# Altium schematic sheet CPU.SchDoc: AMC FMC Carrier v4.0.5
size 420 x 297 mm; CompanyName: WUT; Organization: WUT ISE; Address1: Warsaw University of Technology; Address2: Nowowiejska 15/19 00-665 Warsaw; Address3: t.przywozki@gmail.com; Revision: 1; SheetNumber: 18; SheetTotal: 29; Project: AMC FMC Carrier v4.0.5; ModifiedBy: F. Świtakowski; CheckedDate: -; Title2: MMC; DivGrp: ISE; Designer: T. Przywozki; ModifiedDate: -; ProjectName: ADC/DAC MEZZANINE
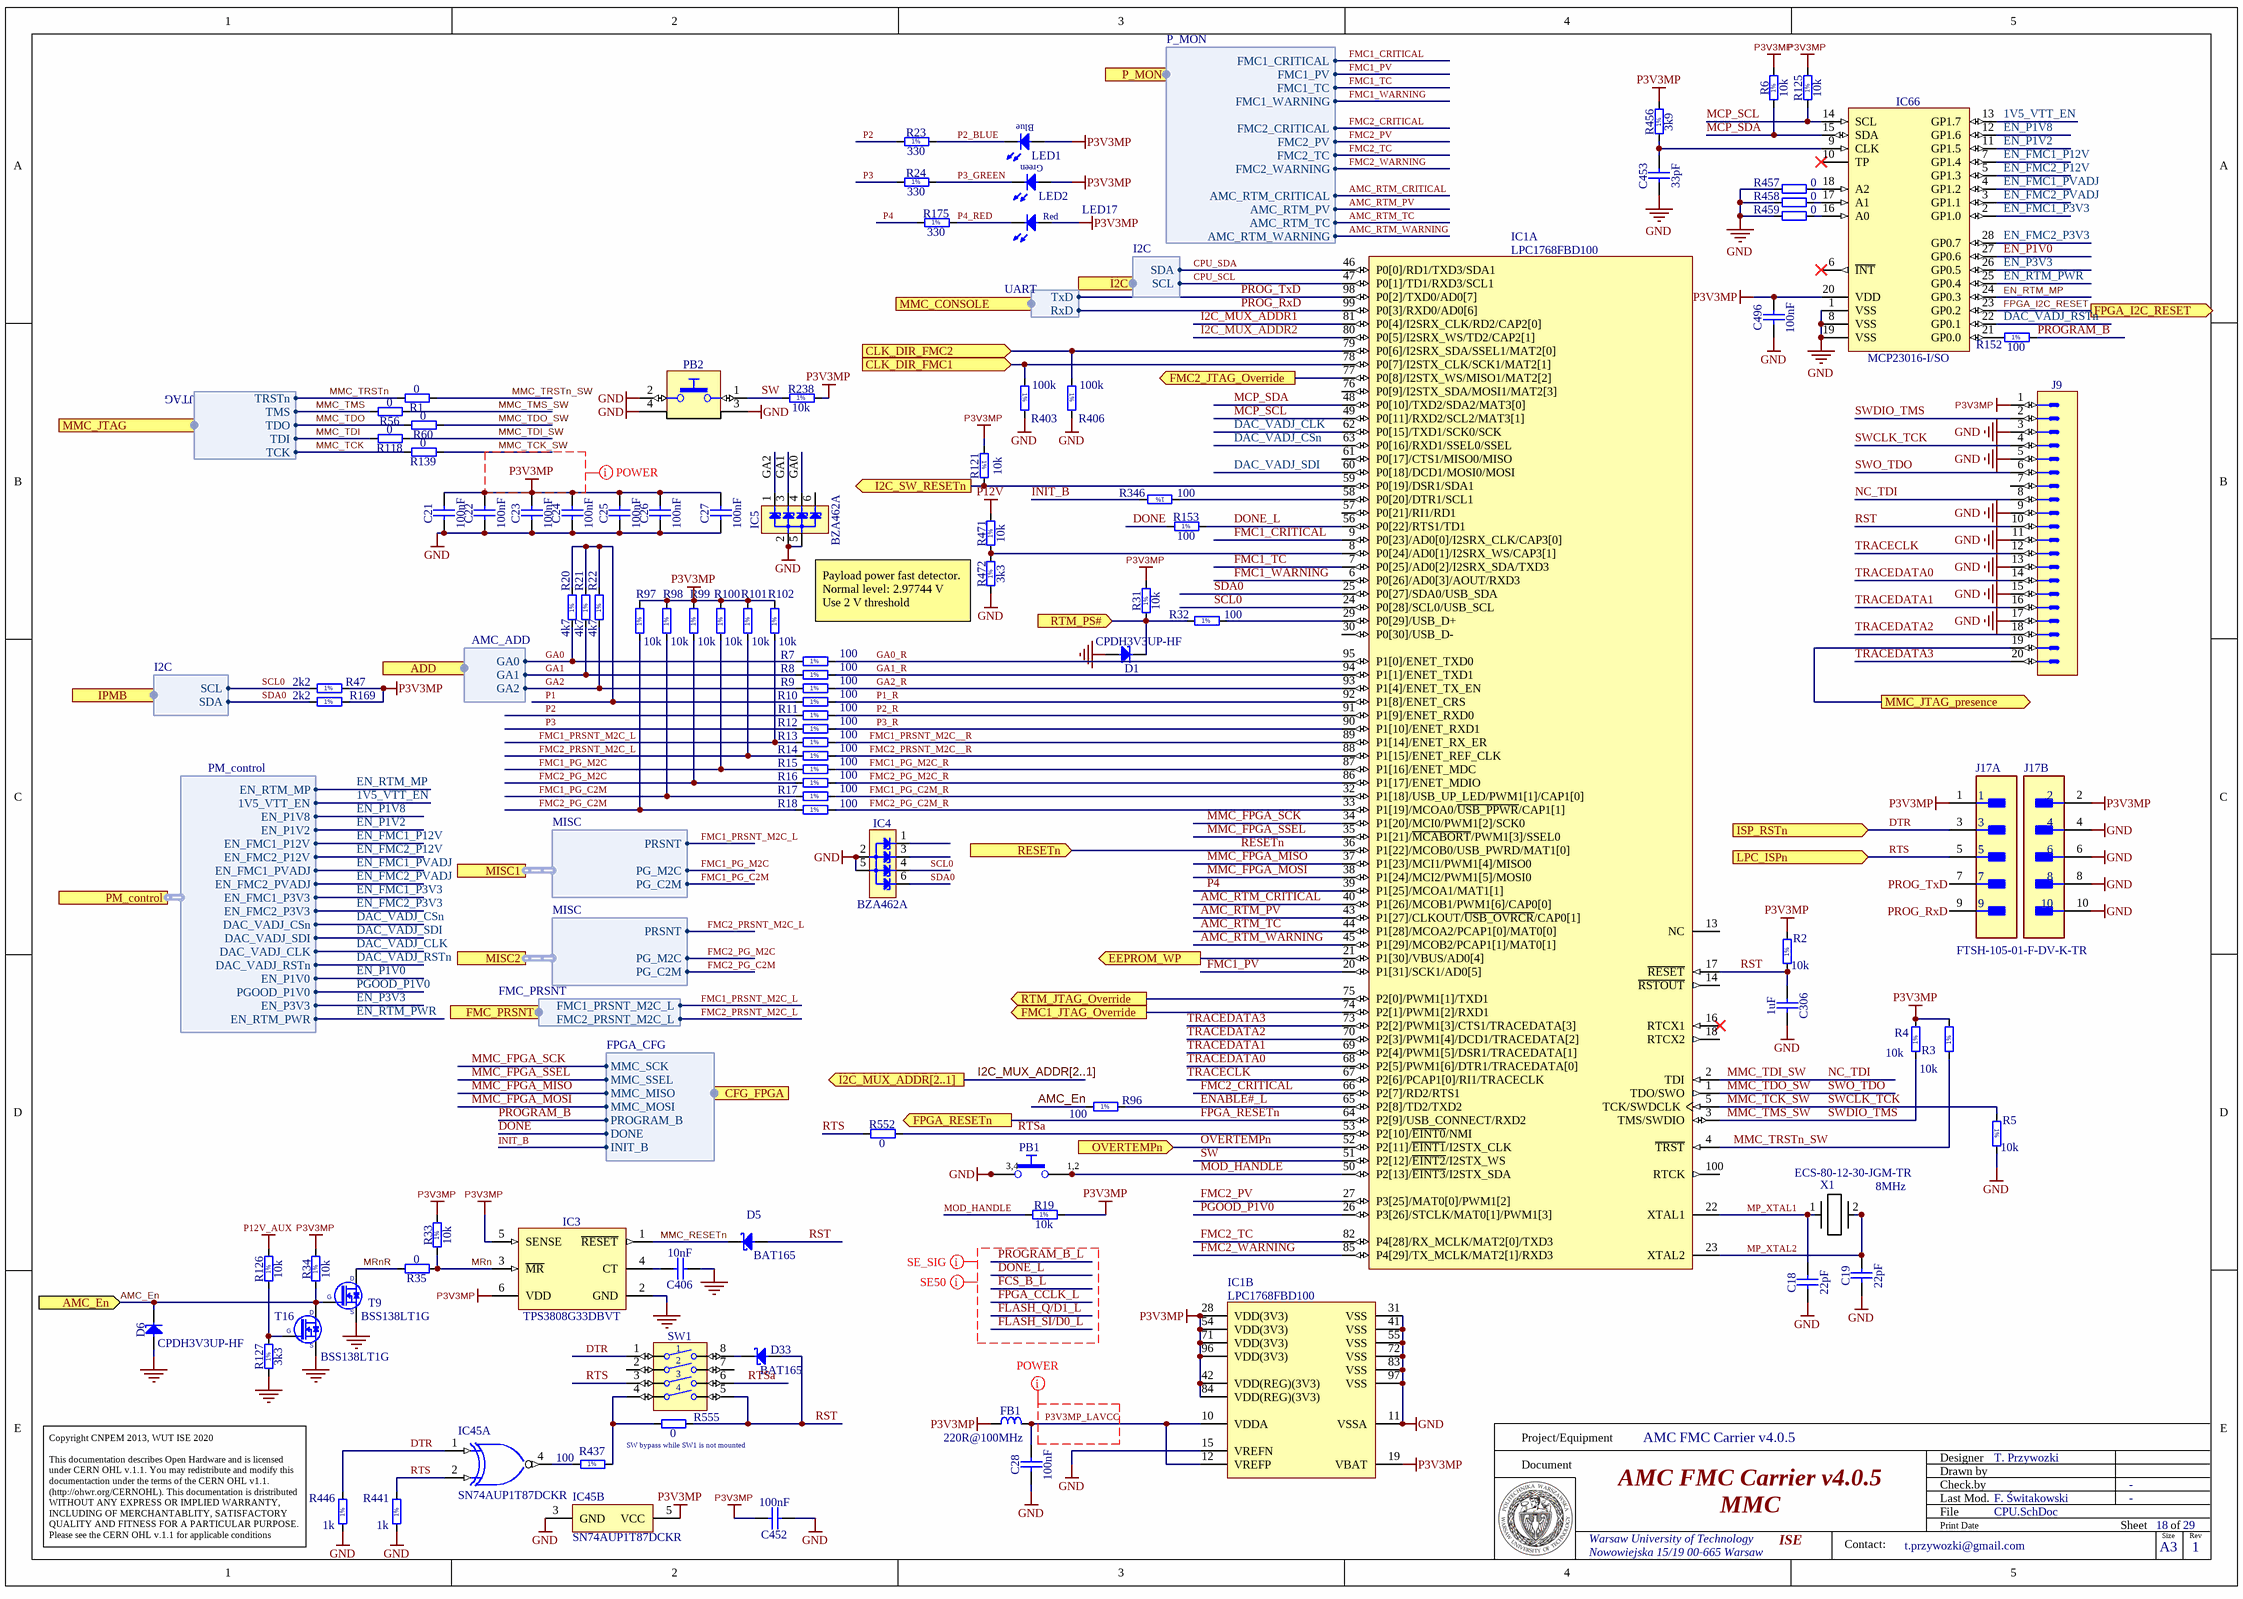
[diagram p0: CPU.SchDoc]

## Parts
C18  22pF  [CAPC1005X55N]
C19  22pF  [CAPC1005X55N]
C21  100nF  [CAPC0603X33N]
C22  100nF  [CAPC0603X33N]
C23  100nF  [CAPC0603X33N]
C24  100nF  [CAPC0603X33N]
C25  100nF  [CAPC0603X33N]
C26  100nF  [CAPC0603X33N]
C27  100nF  [CAPC0603X33N]
C28  100nF  [CAPC0603X33N]
C306  1uF  [CAPC1608X87N]
C406  10nF  [CAPC1005X55N]
C452  100nF  [CAPC0603X33N]
C453  33pF  [CAPC1005X55N]
C496  100nF  [CAPC0603X33N]
D1  CPDH3V3UP-HF  [SODFL1608X65N]
D5  BAT165  [SOD2512X110N]
D6  CPDH3V3UP-HF  [SODFL1608X65N]
D33  BAT165  [SOD2512X110N]
FB1  220R@100MHz  [INDC2012X105N]
IC1  LPC1768FBD100  [QFP50P1600X1600X160-100N]  (parts A,B of 2)
IC3  TPS3808G33DBVT  [SOT95P280X145-6N]
IC4  BZA462A  [SOT95P275X110-6N]
IC5  BZA462A  [SOT95P275X110-6N]
IC45  SN74AUP1T87DCKR  [DCK0005A_L]  (parts A,B of 2)
IC66  MCP23016-I/SO  [SOIC127P1030X265-28N]
J9  Header 20  [SAMTEC_FTSH-110-01-F-DV-K]  (value not drawn)
J17  FTSH-105-01-F-DV-K-TR  [FP-FTSH-105-01-F-DV-K-TR-MFG]  (parts A,B of 2)
LED1  Blue  [LED_AVAGO_HSME-C120rev]  (value not drawn)
LED2  Green  [LED_AVAGO_HSME-C120rev]  (value not drawn)
LED17  Red  [LED_KINGBRIGHT_KPH-1608SURCK]
PB1  Push Button  [SW_C&K_HDT0001]  (value not drawn)
PB2  Push Button  [PB_ALPS_SKHHLMA010]  (value not drawn)
R1  0  [RESC1005X40N]
R2  10k  [RESC1005X40N]
R3  10k  [RESC1005X40N]
R4  10k  [RESC1005X40N]
R5  10k  [RESC1005X40N]
R6  10k  [RESC1005X40N]
R7  100  [RESC1005X40N]
R8  100  [RESC1005X40N]
R9  100  [RESC1005X40N]
R10  100  [RESC1005X40N]
R11  100  [RESC1005X40N]
R12  100  [RESC1005X40N]
R13  100  [RESC1005X40N]
R14  100  [RESC1005X40N]
R15  100  [RESC1005X40N]
R16  100  [RESC1005X40N]
R17  100  [RESC1005X40N]
R18  100  [RESC1005X40N]
R19  10k  [RESC1005X40N]
R20  4k7  [RESC1005X40N]
R21  4k7  [RESC1005X40N]
R22  4k7  [RESC1005X40N]
R23  330  [RESC1005X40N]
R24  330  [RESC1005X40N]
R31  10k  [RESC1005X40N]
R32  100  [RESC1005X40N]
R33  10k  [RESC1005X40N]
R34  10k  [RESC1005X40N]
R35  0  [RESC1005X40N]
R47  2k2  [RESC1005X40N]
R56  0  [RESC1005X40N]
R60  0  [RESC1005X40N]
R96  100  [RESC1005X40N]
R97  10k  [RESC1005X40N]
R98  10k  [RESC1005X40N]
R99  10k  [RESC1005X40N]
R100  10k  [RESC1005X40N]
R101  10k  [RESC1005X40N]
R102  10k  [RESC1005X40N]
R118  0  [RESC1005X40N]
R121  10k  [RESC1005X40N]
R125  10k  [RESC1005X40N]
R126  10k  [RESC1005X40N]
R127  3k3  [RESC1608X55N]
R139  0  [RESC1005X40N]
R152  100  [RESC1005X40N]
R153  100  [RESC1005X40N]
R169  2k2  [RESC1005X40N]
R175  330  [RESC1005X40N]
R238  10k  [RESC1005X40N]
R346  100  [RESC1005X40N]
R403  100k  [RESC1005X40N]
R406  100k  [RESC1005X40N]
R437  100  [RESC1005X40N]
R441  1k  [RESC1005X40N]
R446  1k  [RESC1005X40N]
R456  3k9  [RESC1005X40N]
R457  0  [RESC1005X40N]
R458  0  [RESC1005X40N]
R459  0  [RESC1005X40N]
R471  10k  [RESC1005X40N]
R472  3k3  [RESC1608X55N]
R552  0  [RESC1005X40N]
R555  0  [RESC1005X40N]
SW1  Switch  [SW_TYCO_1571983-4]  (value not drawn)
T9  BSS138LT1G  [SOT95P240X110-3N]
T16  BSS138LT1G  [SOT95P240X110-3N]
X1  ECS-80-12-30-JGM-TR  Frequency: 8MHz  [ECS-80-12-30-JGM-TR]

## Ports
ADD (harness AMC_ADD), AMC_En (in), CFG_FPGA (harness FPGA_CFG), CLK_DIR_FMC1 (in), CLK_DIR_FMC2 (in), EEPROM_WP (out), FMC1_JTAG_Override (out), FMC2_JTAG_Override (out), FMC_PRSNT (harness FMC_PRSNT), FPGA_I2C_RESET (out), FPGA_RESETn (out), I2C (harness I2C), I2C_MUX_ADDR[2..1] (out), I2C_SW_RESETn (out), IPMB (harness I2C), ISP_RSTn (in), LPC_ISPn (in), MISC1 (harness MISC), MISC2 (harness MISC), MMC_CONSOLE (harness UART), MMC_JTAG (harness JTAG), MMC_JTAG_presence (out), OVERTEMPn (in), P_MON (harness P_MON), PM_control (harness PM_control), RESETn (in), RTM_JTAG_Override (out), RTM_PS# (in)

## Harnesses
PM_control: EN_P1V8, EN_P1V2, EN_FMC1_P12V, EN_FMC2_P12V, EN_FMC1_PVADJ, EN_FMC2_PVADJ, EN_FMC1_P3V3, EN_FMC2_P3V3, DAC_VADJ_CSn, DAC_VADJ_SDI, DAC_VADJ_CLK, DAC_VADJ_RSTn, 1V5_VTT_EN, EN_P1V0, PGOOD_P1V0, EN_P3V3, EN_RTM_PWR, EN_RTM_MP
I2C: SCL, SDA
MISC: PRSNT, PG_M2C, PG_C2M
AMC_ADD: GA0, GA1, GA2
JTAG: TCK, TDI, TDO, TMS, TRSTn
UART: RxD, TxD
P_MON: FMC1_CRITICAL, FMC1_TC, FMC1_WARNING, AMC_RTM_CRITICAL, FMC2_WARNING, AMC_RTM_PV, FMC2_CRITICAL, AMC_RTM_TC, FMC2_PV, AMC_RTM_WARNING, FMC2_TC, FMC1_PV
FPGA_CFG: MMC_MISO, MMC_MOSI, PROGRAM_B, DONE, INIT_B, MMC_SSEL, MMC_SCK
FMC_PRSNT: FMC1_PRSNT_M2C_L, FMC2_PRSNT_M2C_L

## Nets
GND: C18.1 C19.1 C21.1 C22.1 C23.1 C24.1 C25.1 C26.1 C27.1 C28.2 C306.2 C406.1 C452.2 C453.1 C496.2 D1.2(A) D6.2(A) IC1.11(VSSA) IC1.15(VREFN) IC1.31(VSS) IC1.41(VSS) IC1.55(VSS) IC1.72(VSS) IC1.83(VSS) IC1.97(VSS) IC3.2(GND) IC4.2(A) IC4.5(A) IC5.2(A) IC5.5(A) IC45.3(GND) IC66.1(VSS) IC66.8(VSS) IC66.19(VSS) J9.3 J9.5 J9.9 J9.11 J9.13 J9.15 J9.17 J17.4 J17.6 J17.8 J17.10 PB1.3 PB1.4 PB2.2 PB2.3 PB2.4 R5.1 R127.1 R403.2 R406.2 R441.1 R446.1 R457.1 R458.1 R459.1 R472.1 T9.2(S) T16.2(S)
P3V3MP: C21.2 C22.2 C23.2 C24.2 C25.2 C26.2 C27.2 C452.1 C496.1 FB1.2 IC1.19(VBAT) IC1.28(VDD(3V3)) IC1.42(VDD(REG)(3V3)) IC1.54(VDD(3V3)) IC1.71(VDD(3V3)) IC1.84(VDD(REG)(3V3)) IC1.96(VDD(3V3)) IC3.5(SENSE) IC3.6(VDD) IC45.5(VCC) IC66.20(VDD) J9.1 J17.1 J17.2 LED1.1(A) LED2.1(A) LED17.2(A) R2.2 R3.2 R4.2 R6.2 R19.2 R31.2 R33.2 R34.2 R47.1 R97.2 R98.2 R99.2 R100.2 R101.2 R102.2 R121.1 R125.2 R169.1 R238.2 R456.2
P12V: R471.2
P12V_AUX: R126.2
1V5_VTT_EN: IC66.13(GP1.7) ; port PM_control.1V5_VTT_EN
AMC_En: D6.1(C) R34.1 R96.1 T9.1(G) T16.3(D) ; port AMC_En
AMC_RTM_CRITICAL: IC1.40(P1[26]/MCOB1/PWM1[6]/CAP0[0]) ; port P_MON.AMC_RTM_CRITICAL
AMC_RTM_PV: IC1.43(P1[27]/CLKOUT/~{USB_OVRCR}/CAP0[1]) ; port P_MON.AMC_RTM_PV
AMC_RTM_TC: IC1.44(P1[28]/MCOA2/PCAP1[0]/MAT0[0]) ; port P_MON.AMC_RTM_TC
AMC_RTM_WARNING: IC1.45(P1[29]/MCOB2/PCAP1[1]/MAT0[1]) ; port P_MON.AMC_RTM_WARNING
CLK_DIR_FMC1: IC1.78(P0[7]/I2STX_CLK/SCK1/MAT2[1]) R403.1 ; port CLK_DIR_FMC1
CLK_DIR_FMC2: IC1.79(P0[6]/I2SRX_SDA/SSEL1/MAT2[0]) R406.1 ; port CLK_DIR_FMC2
CPU_SCL: IC1.47(P0[1]/TD1/RXD3/SCL1) ; port I2C.SCL
CPU_SDA: IC1.46(P0[0]/RD1/TXD3/SDA1) ; port I2C.SDA
DAC_VADJ_CLK: IC1.62(P0[15]/TXD1/SCK0/SCK) ; port PM_control.DAC_VADJ_CLK
DAC_VADJ_CSn: IC1.63(P0[16]/RXD1/SSEL0/SSEL) ; port PM_control.DAC_VADJ_CSn
DAC_VADJ_RSTn: IC66.22(GP0.1) ; port PM_control.DAC_VADJ_RSTn
DAC_VADJ_SDI: IC1.60(P0[18]/DCD1/MOSI0/MOSI) ; port PM_control.DAC_VADJ_SDI
DONE: R153.2 ; port CFG_FPGA.DONE
DONE_L: IC1.56(P0[22]/RTS1/TD1) R153.1
DTR: IC45.1(A) J17.3 R446.2 SW1.1 ; port ISP_RSTn
EEPROM_WP: IC1.21(P1[30]/VBUS/AD0[4]) ; port EEPROM_WP
EN_FMC1_P3V3: IC66.2(GP1.0) ; port PM_control.EN_FMC1_P3V3
EN_FMC1_P12V: IC66.7(GP1.4) ; port PM_control.EN_FMC1_P12V
EN_FMC1_PVADJ: IC66.4(GP1.2) ; port PM_control.EN_FMC1_PVADJ
EN_FMC2_P3V3: IC66.28(GP0.7) ; port PM_control.EN_FMC2_P3V3
EN_FMC2_P12V: IC66.5(GP1.3) ; port PM_control.EN_FMC2_P12V
EN_FMC2_PVADJ: IC66.3(GP1.1) ; port PM_control.EN_FMC2_PVADJ
EN_P1V0: IC66.27(GP0.6) ; port PM_control.EN_P1V0
EN_P1V2: IC66.11(GP1.5) ; port PM_control.EN_P1V2
EN_P1V8: IC66.12(GP1.6) ; port PM_control.EN_P1V8
EN_P3V3: IC66.26(GP0.5) ; port PM_control.EN_P3V3
EN_RTM_MP: IC66.24(GP0.3) ; port PM_control.EN_RTM_MP
EN_RTM_PWR: IC66.25(GP0.4) ; port PM_control.EN_RTM_PWR
ENABLE#_L: IC1.65(P2[8]/TD2/TXD2) R96.2
FMC1_CRITICAL: IC1.9(P0[23]/AD0[0]/I2SRX_CLK/CAP3[0]) ; port P_MON.FMC1_CRITICAL
FMC1_JTAG_Override: IC1.74(P2[1]/PWM1[2]/RXD1) ; port FMC1_JTAG_Override
FMC1_PG_C2M: R17.1 R98.1 ; port MISC1.PG_C2M
FMC1_PG_C2M_R: IC1.32(P1[18]/USB_UP_LED/PWM1[1]/CAP1[0]) R17.2
FMC1_PG_M2C: R15.1 R100.1 ; port MISC1.PG_M2C
FMC1_PG_M2C_R: IC1.87(P1[16]/ENET_MDC) R15.2
FMC1_PRSNT_M2C__R: IC1.89(P1[14]/ENET_RX_ER) R13.2
FMC1_PRSNT_M2C_L: R13.1 R102.1 ; port MISC1.PRSNT, port FMC_PRSNT.FMC1_PRSNT_M2C_L
FMC1_PV: IC1.20(P1[31]/SCK1/AD0[5]) ; port P_MON.FMC1_PV
FMC1_TC: IC1.7(P0[25]/AD0[2]/I2SRX_SDA/TXD3) ; port P_MON.FMC1_TC
FMC1_WARNING: IC1.6(P0[26]/AD0[3]/AOUT/RXD3) ; port P_MON.FMC1_WARNING
FMC2_CRITICAL: IC1.66(P2[7]/RD2/RTS1) ; port P_MON.FMC2_CRITICAL
FMC2_JTAG_Override: IC1.77(P0[8]/I2STX_WS/MISO1/MAT2[2]) ; port FMC2_JTAG_Override
FMC2_PG_C2M: R18.1 R97.1 ; port MISC2.PG_C2M
FMC2_PG_C2M_R: IC1.33(P1[19]/MCOA0/~{USB_PPWR}/CAP1[1]) R18.2
FMC2_PG_M2C: R16.1 R99.1 ; port MISC2.PG_M2C
FMC2_PG_M2C_R: IC1.86(P1[17]/ENET_MDIO) R16.2
FMC2_PRSNT_M2C__R: IC1.88(P1[15]/ENET_REF_CLK) R14.2
FMC2_PRSNT_M2C_L: R14.1 R101.1 ; port MISC2.PRSNT, port FMC_PRSNT.FMC2_PRSNT_M2C_L
FMC2_PV: IC1.27(P3[25]/MAT0[0]/PWM1[2]) ; port P_MON.FMC2_PV
FMC2_TC: IC1.82(P4[28]/RX_MCLK/MAT2[0]/TXD3) ; port P_MON.FMC2_TC
FMC2_WARNING: IC1.85(P4[29]/TX_MCLK/MAT2[1]/RXD3) ; port P_MON.FMC2_WARNING
FPGA_I2C_RESET: IC66.23(GP0.2) ; port FPGA_I2C_RESET
FPGA_RESETn: IC1.64(P2[9]/USB_CONNECT/RXD2) ; port FPGA_RESETn
GA0: IC5.4(C3) R7.1 R20.1 ; port ADD.GA0
GA0_R: IC1.95(P1[0]/ENET_TXD0) R7.2
GA1: IC5.3(C2) R8.1 R21.1 ; port ADD.GA1
GA1_R: IC1.94(P1[1]/ENET_TXD1) R8.2
GA2: IC5.1(C1) R9.1 R22.1 ; port ADD.GA2
GA2_R: IC1.93(P1[4]/ENET_TX_EN) R9.2
I2C_MUX_ADDR1: IC1.81(P0[4]/I2SRX_CLK/RD2/CAP2[0])
I2C_MUX_ADDR2: IC1.80(P0[5]/I2SRX_WS/TD2/CAP2[1])
I2C_SW_RESETn: IC1.59(P0[19]/DSR1/SDA1) R121.2 ; port I2C_SW_RESETn
INIT_B: R346.1 ; port CFG_FPGA.INIT_B
MCP_SCL: IC1.49(P0[11]/RXD2/SCL2/MAT3[1]) IC66.14(SCL) R125.1
MCP_SDA: IC1.48(P0[10]/TXD2/SDA2/MAT3[0]) IC66.15(SDA) R6.1
MMC_FPGA_MISO: IC1.37(P1[23]/MCI1/PWM1[4]/MISO0) ; port CFG_FPGA.MMC_MISO
MMC_FPGA_MOSI: IC1.38(P1[24]/MCI2/PWM1[5]/MOSI0) ; port CFG_FPGA.MMC_MOSI
MMC_FPGA_SCK: IC1.34(P1[20]/MCI0/PWM1[2]/SCK0) ; port CFG_FPGA.MMC_SCK
MMC_FPGA_SSEL: IC1.35(P1[21]/~{MCABORT}/PWM1[3]/SSEL0) ; port CFG_FPGA.MMC_SSEL
MMC_JTAG_presence: J9.19 ; port MMC_JTAG_presence
MMC_RESETn: D5.1(C) IC3.1(~{RESET})
MMC_TCK: R139.2 ; port MMC_JTAG.TCK
MMC_TCK_SW: IC1.5(TCK/SWDCLK) J9.4 R5.2 R139.1  [also labelled SWCLK_TCK]
MMC_TDI: R118.2 ; port MMC_JTAG.TDI
MMC_TDI_SW: IC1.2(TDI) J9.8 R118.1  [also labelled NC_TDI]
MMC_TDO: R60.2 ; port MMC_JTAG.TDO
MMC_TDO_SW: IC1.1(TDO/SWO) J9.6 R60.1  [also labelled SWO_TDO]
MMC_TMS: R56.2 ; port MMC_JTAG.TMS
MMC_TMS_SW: IC1.3(TMS/SWDIO) J9.2 R4.1 R56.1  [also labelled SWDIO_TMS]
MMC_TRSTn: R1.2 ; port MMC_JTAG.TRSTn
MMC_TRSTn_SW: IC1.4(~{TRST}) R1.1 R3.1
MOD_HANDLE: IC1.50(P2[13]/~{EINT3}/I2STX_SDA) PB1.1 PB1.2 R19.1
MP_XTAL1: C18.2 IC1.22(XTAL1) X1.1
MP_XTAL2: C19.2 IC1.23(XTAL2) X1.2
MRn: IC3.3(~{MR}) R33.1 R35.1
MRnR: R35.2 T9.3(D)
OVERTEMPn: IC1.52(P2[11]/~{EINT1}/I2STX_CLK) ; port OVERTEMPn
P1: R10.1 R20.2 R21.2 R22.2
P1_R: IC1.92(P1[8]/ENET_CRS) R10.2
P2: R11.1 R23.1
P2_BLUE: LED1.2(C) R23.2
P2_R: IC1.91(P1[9]/ENET_RXD0) R11.2
P3: R12.1 R24.1
P3_GREEN: LED2.2(C) R24.2
P3_R: IC1.90(P1[10]/ENET_RXD1) R12.2
P3V3MP_LAVCC: C28.1 FB1.1 IC1.10(VDDA) IC1.12(VREFP)
P4: IC1.39(P1[25]/MCOA1/MAT1[1]) R175.1
P4_RED: LED17.1(C) R175.2
PGOOD_P1V0: IC1.26(P3[26]/STCLK/MAT0[1]/PWM1[3]) ; port PM_control.PGOOD_P1V0
PROG_RxD: IC1.99(P0[3]/RXD0/AD0[6]) J17.9 ; port MMC_CONSOLE.RxD
PROG_TxD: IC1.98(P0[2]/TXD0/AD0[7]) J17.7 ; port MMC_CONSOLE.TxD
PROGRAM_B: R152.1 ; port CFG_FPGA.PROGRAM_B
RESETn: IC1.36(P1[22]/MCOB0/USB_PWRD/MAT1[0]) ; port RESETn
RST: C306.1 D5.2(A) D33.2(A) IC1.17(~{RESET}) J9.10 R2.1 R555.2 SW1.5
RTM_JTAG_Override: IC1.75(P2[0]/PWM1[1]/TXD1) ; port RTM_JTAG_Override
RTM_PS#: D1.1(C) R31.1 R32.2 ; port RTM_PS#
RTS: IC45.2(B) J17.5 R441.2 R552.1 SW1.3 ; port LPC_ISPn
RTSa: IC1.53(P2[10]/~{EINT0}/NMI) R552.2 SW1.6
SCL0: IC1.24(P0[28]/SCL0/USB_SCL) IC4.4(C3) R47.2 ; port IPMB.SCL
SDA0: IC1.25(P0[27]/SDA0/USB_SDA) IC4.6(C4) R169.2 ; port IPMB.SDA
SW: IC1.51(P2[12]/~{EINT2}/I2STX_WS) PB2.1 R238.1
TRACECLK: IC1.67(P2[6]/PCAP1[0]/RI1/TRACECLK) J9.12
TRACEDATA0: IC1.68(P2[5]/PWM1[6]/DTR1/TRACEDATA[0]) J9.14
TRACEDATA1: IC1.69(P2[4]/PWM1[5]/DSR1/TRACEDATA[1]) J9.16
TRACEDATA2: IC1.70(P2[3]/PWM1[4]/DCD1/TRACEDATA[2]) J9.18
TRACEDATA3: IC1.73(P2[2]/PWM1[3]/CTS1/TRACEDATA[3]) J9.20
NetC406_2: C406.2 IC3.4(CT)
NetC453_2: C453.2 IC66.9(CLK) R456.1
NetD33_1: D33.1(C) SW1.8
NetIC1_8: IC1.8(P0[24]/AD0[1]/I2SRX_WS/CAP3[1]) R471.1 R472.2
NetIC1_29: IC1.29(P0[29]/USB_D+) R32.1
NetIC1_58: IC1.58(P0[20]/DTR1/SCL1) R346.2
NetIC45_4: IC45.4(Y) R437.1
NetIC66_16: IC66.16(A0) R459.2
NetIC66_17: IC66.17(A1) R458.2
NetIC66_18: IC66.18(A2) R457.2
NetIC66_21: IC66.21(GP0.0) R152.2
NetR126_1: R126.1 R127.2 T16.1(G)
NetR437_2: R437.2 R555.1 SW1.4

Not connected (* = marked no-connect by the designer): IC1 13(NC) 14(~{RSTOUT}) 16(RTCX1)* 18(RTCX2) 30(P0[30]/USB_D-) 57(P0[21]/RI1/RD1) 61(P0[17]/CTS1/MISO0/MISO) 76(P0[9]/I2STX_SDA/MOSI1/MAT2[3]) 100(RTCK); IC4 1(C1) 3(C2); IC5 6(C4); IC66 6(~{INT})* 10(TP)*; J9 7; SW1 2 7

## Buses and harness runs
bus I2C_MUX_ADDR[2..1] = port I2C_MUX_ADDR[2..1]

## Layout directives
net class POWER: MMC_TCK_SW, P3V3MP, P3V3MP_LAVCC
net class SE_SIG: DONE_L, FCS_~{B}_L, FLASH_Q/D1_L, FLASH_SI/D0_L, FPGA_CCLK_L, PROGRAM_B_L
net class SE50: DONE_L, FCS_~{B}_L, FLASH_Q/D1_L, FLASH_SI/D0_L, FPGA_CCLK_L, PROGRAM_B_L

## Notes on the sheet
- Payload power fast detector.
  Normal level: 2.97744 V
  Use 2 V threshold
- SW bypass while SW1 is not mounted
- Project/Equipment
- Document
- Designer
- Drawn by
- Check.by
- Copyright CNPEM 2013, WUT ISE 2020
  This documentation describes Open Hardware and is licensed under CERN OHL v.1.1. You may redistribute and modify this documentaction under the terms of the CERN OHL v1.1.
  (http://ohwr.org/CERNOHL). This documentation is dristributed WITHOUT ANY EXPRESS OR IMPLIED WARRANTY, INCLUDING OF MERCHANTABLITY, SATISFACTORY QUALITY AND FITNESS FOR A PARTICULAR PURPOSE. Please see the CERN OHL v.1.1 for applicable conditions
- File
- Last Mod.
- Print Date
- Sheet
- Size
- A3
- of
- Rev
- Contact:
- (in symbol R0402_1K_1%_0.0625W_100PPM) 1%
- (in symbol R0402_2K2_1%_0.0625W_100PPM) 1%
- (in symbol R0402_3K9_1%_0.0625W_100PPM) 1%
- (in symbol R0402_4K7_1%_0.0625W_100PPM) 1%
- (in symbol R0402_10K_1%_0.0625W_100PPM) 1%
- (in symbol R0402_100K_1%_0.0625W_100PPM) 1%
- (in symbol R0402_100R_1%_0.1W_100PPM) 1%
- (in symbol R0402_100R_1%_0.0625W_100PPM) 1%
- (in symbol R0402_330R_1%_0.0625W_100PPM) 1%
- (in symbol R0603_3K3_1%_0.1W_100PPM) 1%
- (in symbol SW_C&K_HDT0001) 3,4; 1,2

## Library data of the parts
C18 C19 = CC0402_22PF_50V_5%_NP0: Non-polarised capacitor; Part Description: SMD Multilayer Chip Ceramic Capacitor; Manufacturer: GENERIC; Manufacturer1 Part Number: 223886915229; Voltage: 50V; TC: NP0; Tolerance: ±5%; Table: Capacitors SMD; Part Number: CC0402_22PF_50V_5%_NP0; Component Kind: Standard; Component Type: Standard; Pin Count: 2; Value: 22pF; Status: Not Recommended; Manufacturer Part Number: CC0402_22PF_50V_5%_NP0; Case: 0402; Mounted: Yes; Socket: No; SMD: Yes; Manufacturer1 Example: PHYCOMP; Manufacturer1 ComponentHeight: 0.55mm; HelpURL: \\cern.ch\dfs\Applications\Altium\Datasheets\CC0402_NP0_PHYCOMP.pdf; Author: CERN DEM JLC; CreateDate: 2007-12-03; LatestRevisionDate: 2007-12-03
C21-C28 C452 C496 = CC0201_100NF_6.3V_10%_X5R: Non-polarised capacitor; Part Description: SMD Multilayer Chip Ceramic Capacitor; Manufacturer: GENERIC; Manufacturer1 Part Number: 02016D104KAT2A; Voltage: 6.3V; TC: X5R; Tolerance: ±10%; Table: Capacitors SMD; Part Number: CC0201_100NF_6.3V_10%_X5R; Component Kind: Standard; Component Type: Standard; Pin Count: 2; Value: 100nF; Status: Not Recommended; Manufacturer Part Number: CC0201_100NF_6.3V_10%_X5R; Case: 0201; Mounted: Yes; Socket: No; SMD: Yes; Manufacturer1 Example: AVX; Manufacturer1 ComponentHeight: 0.33mm; HelpURL: \\cern.ch\dfs\Applications\Altium\Datasheets\CC0201_X5R_AVX.pdf; Author: CERN DEM JLC; CreateDate: 2007-12-03; LatestRevisionDate: 2007-12-03
C306 = CC0603_1UF_16V_10%_X7R: Non-polarised capacitor; Part Description: SMD Multilayer Chip Ceramic Capacitor; Manufacturer: GENERIC; Manufacturer1 Part Number: 223824613663; Voltage: 16V; TC: X7R; Tolerance: ±10%; Table: Capacitors SMD; Part Number: CC0603_1UF_16V_10%_X7R; Component Kind: Standard; Component Type: Standard; Pin Count: 2; Value: 1uF; Status: Preferred; Manufacturer Part Number: CC0603_1uF_16V_10%_X7R; Case: 0603; Mounted: Yes; Socket: No; SMD: Yes; Manufacturer1 Example: PHYCOMP; Manufacturer1 ComponentHeight: 0.87mm; HelpURL: \\cern.ch\dfs\Applications\Altium\Datasheets\CC0805_X5R_PHYCOMP_HC.pdf; Author: CERN DEM JLC; CreateDate: 2007-12-03; LatestRevisionDate: 2007-12-03
C406 = CC0402_10NF_16V_10%_X7R: Non-polarised capacitor; Manufacturer: GENERIC; Part Description: SMD Multilayer Chip Ceramic Capacitor; Manufacturer1 Part Number: 223878715636; Tolerance: ±10%; Voltage: 16V; TC: X7R; Manufacturer Part Number: CC0402_10NF_16V_10%_X7R; Part Number: CC0402_10NF_16V_10%_X7R; Value: 10nF; Component Kind: Standard; Component Type: Standard; Pin Count: 2; Status: Not Recommended; Case: 0402; Mounted: Yes; Socket: No; SMD: Yes; Sense: No; Manufacturer1 Example: PHYCOMP; Manufacturer1 ComponentHeight: 0.55mm; HelpURL: \\cern.ch\dfs\Applications\Altium\Datasheets\CC0402_X7R_PHYCOMP.pdf; Author: CERN DEM JLC; CreateDate: 03.12.2007; LatestRevisionDate: 03.12.2007
C453 = CC0402_33PF_50V_5%_C0G: Non-polarised capacitor; Part Description: SMD Multilayer Chip Ceramic Capacitor; Manufacturer: GENERIC; Manufacturer1 Part Number: C0402C330J5GACTU; Voltage: 50V; TC: C0G/NP0; Tolerance: ±5%; Part Number: CC0402_33PF_50V_5%_C0G; Component Kind: Standard; Component Type: Standard; Pin Count: 2; Value: 33pF; Status: Preferred; Manufacturer Part Number: CC0402_33PF_50V_5%_C0G; Case: 0402; Mounted: Yes; Socket: No; SMD: Yes; Sense: No; Manufacturer1 Example: KEMET; Manufacturer1 ComponentHeight: 0.55mm; HelpURL: \\cern.ch\dfs\Applications\Altium\Datasheets\CC0402_C0G_KEMET_(Commercial Grade).pdf; Author: CERN DEM JLC; CreateDate: 03.12.2007; LatestRevisionDate: 22.04.2015
D1 D6 = PESD3V3S1UB: ESD protection diode; Manufacturer: Comchip Technology; PressFit: No; Bonding: No; Manufacturer Part Number: CPDH3V3UP-HF; Part Number: CPDH3V3UP-HF; Component Kind: Standard; Component Type: Standard; Device: CPDH3V3UP-HF; Pin Count: 2; Case: SOD523; Mounted: Yes; Socket: No; SMD: Yes; Sense: No; ComponentHeight: 0.65mm; Author: CERN DEM JLC; CreateDate: 29.11.2012; LatestRevisionDate: 29.11.2012
D5 D33 = BAT165: Schottky Diode; Manufacturer: INFINEON; Part Description: Medium Power AF Schottky Diode; Voltage: 40V; Power: 750mA; PressFit: No; Bonding: No; Manufacturer Part Number: BAT165; PackageDescription: Small Outline Diode (SOD-323), 1.70mm W X 1.25mm L X 1.10mm H body,  IPC Medium Density; Part Number: BAT165; Component Kind: Standard; Component Type: Standard; Device: BAT165; Pin Count: 2; Case: SOD323; Mounted: Yes; Socket: No; SMD: Yes; Sense: No; ComponentHeight: 1.1mm; HelpURL: \\cern.ch\dfs\Applications\Altium\Datasheets\BAT165.pdf; Author: CERN DEM JLC; CreateDate: 12.11.2014; LatestRevisionDate: 12.11.2014
FB1 = IND0805_MURATA_BLM21PG221SN1D: Inductor; Part Description: SMD EMIFIL Suppression Chip Ferrite Bead; Manufacturer: MURATA; Power: 2A; Resistance: 0.05R; Tolerance: ±25%; Table: Inductors SMD; Part Number: IND0805_MURATA_BLM21PG221SN1D; Component Kind: Standard; Component Type: Standard; Pin Count: 2; Value: 220R@100MHz; Status: None; Manufacturer Part Number: BLM21PG221SN1D; Case: 0805; Mounted: Yes; Socket: No; SMD: Yes; ComponentHeight: 1.05mm; HelpURL: \\cern.ch\dfs\Applications\Altium\Datasheets\IND0402_MURATA_BLM21P.pdf; Author: CERN DEM JLC; CreateDate: 2010-01-25; LatestRevisionDate: 2010-01-25
IC1 = LPC1768FBD100: LPC1768 Series 64kB 100MHz 32-Bit ARM Cortex-M3 Microcontroller; Part Description: 32-bit 100MHz ARM Cortex-M3 Microcontroller, 512kB Flash, 64kB SRAM, with Ethernet, USB 2.0 Host/Device/OTG, CAN; Manufacturer: NXP SEMICONDUCTORS; PressFit: No; Bonding: No; Part Number: LPC1768FBD100; Component Kind: Standard; Component Type: Standard; Device: LPC1768FBD100; PackageDescription: QFP, 0.50mm Pitch, Square; 100 Pin,14.00mm L X 14.00mm W X 1.60mm H Body, IPC Medium Density; Manufacturer Part Number: LPC1768FBD100; Pin Count: 100; Case: QFP100; Mounted: Yes; Socket: No; SMD: Yes; Sense: No; ComponentHeight: 1.6mm; HelpURL: \\cern.ch\dfs\Applications\Altium\Datasheets\LPC1768FBD100.pdf; Author: CERN DEM JLC; CreateDate: 06.10.2016; LatestRevisionDate: 06.10.2016
IC3 = TPS3808G33DBVT: Low Quiescent Current, Programmable-Delay Supervisory Circuit; Manufacturer: TEXAS INSTRUMENTS; Part Description: 3.3V, Low Quiescent Current, Programmable-Delay Supervisory Circuit; PressFit: No; Bonding: No; Manufacturer Part Number: TPS3808G33DBVT; PackageDescription: SOT23, 6-Leads, Body 1.6x3.0mm, Pitch 0.95mm, IPC Medium Density; Part Number: TPS3808G33DBVT; Component Kind: Standard; Component Type: Standard; Device: TPS3808G33DBVT; Pin Count: 6; Case: SOT23-6; Mounted: Yes; Socket: No; SMD: Yes; Sense: No; ComponentHeight: 1.45mm; Author: CERN DEM JLC; HelpURL: \\cern.ch\dfs\Applications\Altium\Datasheets\TPS3808G33DBVT.pdf; CreateDate: 05.11.2013; LatestRevisionDate: 05.11.2013
IC4 IC5 = BZA462A: Quadruple ESD Transient Voltage Suppressor; Manufacturer: NXP SEMICONDUCTORS; Voltage: 15kV; Power: 24W; PressFit: No; Bonding: No; Part Number: BZA462A; Component Kind: Standard; Component Type: Standard; Device: BZA462A; PackageDescription: SOT, 0.95mm Pitch; 6 Pin, 1.50mm W X 2.90mm L X 1.10mm H body, IPC Medium Density; Part Description: Quadruple ESD Transient Voltage Suppressor; Manufacturer Part Number: BZA462A; Pin Count: 3; Case: SOT23-6; Mounted: Yes; Socket: No; SMD: Yes; Sense: No; ComponentHeight: 1.1mm; HelpURL: \\cern.ch\dfs\Applications\Altium\Datasheets\BZA462A.pdf; Author: CERN DEM JLC; CreateDate: 09.11.2016; LatestRevisionDate: 09.11.2016
IC45 = CMP-0859-00314-3: Low Power, 1.8/2.5/3.3-V In, 3.3-V CMOS Out, 2-Input Positive Exclusive-NOR Gate, DCK0005A, LARGE T&R; Manufacturer: Texas Instruments; Bits(#): 1; tpd @ Nom Voltage(Max)(ns): 9.8,8.5,7.8; Rating: Catalog; F @ Nom Voltage(Max)(Mhz): 190; Output Drive (IOL/IOH)(Max)(mA): 4/-4; ICC @ Nom Voltage(Max)(mA): 0.0009; Technology Family: AUP1T; VCC(Min)(V): 0.8; Voltage(Nom)(V): 1.8,2.5,3.3; VCC(Max)(V): 3.6; 3-State Output: No; Sub-Family: Single Supply Translator; Logic: True; Generic Part Number: SN74AUP1T87; Operating Temperature Range(C): -40 to 85; Output Type: CMOS; PackageReference: DCK0005A; Input Type: CMOS; DatasheetVersion: SCES806; Schmitt Trigger: No
IC66 = MCP23016-I/SO: 16-bit I/O I2C I/O Expander; Part Description: 16-bit I2C I/O Expander; Manufacturer: MICROCHIP TECHNOLOGY; PressFit: No; Bonding: No; Part Number: MCP23016-I/SO; Component Kind: Standard; Component Type: Standard; Device: MCP23016-I/SO; PackageDescription: SOIC,1.27mm, Pitch;28 Pin, 7.50mm W X 17.90mm L X 2.65mm H body, IPC Medium Density; Manufacturer Part Number: MCP23016-I/SO; Pin Count: 28; Case: SOIC28; Mounted: Yes; Socket: No; SMD: Yes; Sense: No; ComponentHeight: 2.65mm; Author: CERN DEM JLC; HelpURL: \\cern.ch\dfs\Applications\Altium\Datasheets\MCP23016-I-SO.pdf; CreateDate: 13.08.2012; LatestRevisionDate: 14.08.2012
J9 = SAMTEC_FTSH-110-01-F-DV-K: Connector 20 Male; Part Description: 20 Contacts, Pitch 1.27mm, Dual Row Straight Shrouded SMT Micro Header with Keying Shroud; Manufacturer: SAMTEC; PressFit: No; Part Number: SAMTEC_FTSH-110-01-F-DV-K; Component Kind: Standard; Component Type: Standard; Pin Count: 20; Family: Header 20; Mounted: Yes; Socket: No; SMD: Yes; Sense: No; Status: None; Manufacturer Part Number: FTSH-110-01-F-DV-K; ComponentHeight: 6.25mm; HelpURL: \\cern.ch\dfs\Applications\Altium\Datasheets\SAMTEC_FTSH-110-01-F-DV-K.pdf; Author: CERN DEM JLC; CreateDate: 18.03.2019; LatestRevisionDate: 18.03.2019
J17 = CMP-02766-000004-2: CONN HEADER SMD 10POS 1.27MM; Number of Contacts: 10; Max Current Rating: 1.75A; Max Operating Temperature: 125°C; Number of Rows: 2; Pitch: 1.27mm; Contact Plating: Gold; Length: 6.35mm; Min Operating Temperature: -55°C; Packaging: Tape and Reel; Orientation: Straight; Contact Material: Bronze; Depth: 3.43mm; Housing Color: Black; Housing Material: Polymer; Radiation Hardening: No; Termination: Solder; Lead Free: Lead Free
LED1 = LED_SMD_90deg_mini_B: LED Blue Avago C120; Part Number: LED_AVAGO_HSMR-C120; Part Description: High Performance Right Angle Chip Blue LED; Manufacturer: AVAGO TECHNOLOGIES; Manufacturer Part Number: HSMR-C120; Table: LEDs & Displays; Component Kind: Standard; Component Type: Standard; Color: Blue; Footprint: LED_AVAGO_HSMR-C120; PackageDescription: Blue Chip LED, 2-Leads, Body 1.7x1.1mm, Side Emitting Package; Pin Count: 2; Mounted: Yes; Socket: No; SMD: Yes; ComponentHeight: 0.7mm; HelpURL: \\cern.ch\dfs\Applications\Altium\Datasheets\LED_AVAGO_HSME-C120.pdf; ComponentLink1URL: \\cern.ch\dfs\Applications\Altium\Datasheets\LED_AVAGO_HSME-C110_DESIGN-GUIDE.pdf; ComponentLink1Description: Design Guide; Author: CERN DEM JMW; CreateDate: 2009-07-22; LatestRevisionDate: 2012-06-20
LED2 = LED_SMD_90deg_mini_G: LED Green Avago C120; Part Number: LED_AVAGO_HSME-C120; Part Description: High Performance Right Angle Chip Green LED; Manufacturer: AVAGO TECHNOLOGIES; Manufacturer Part Number: HSME-C120; Table: LEDs & Displays; Component Kind: Standard; Component Type: Standard; Color: Green; Footprint: LED_AVAGO_HSME-C120; PackageDescription: Green Chip LED, 2-Leads, Body 1.7x1.1mm, Side Emitting Package; Pin Count: 2; Mounted: Yes; Socket: No; SMD: Yes; ComponentHeight: 0.7mm; HelpURL: \\cern.ch\dfs\Applications\Altium\Datasheets\LED_AVAGO_HSME-C120.pdf; ComponentLink1URL: \\cern.ch\dfs\Applications\Altium\Datasheets\LED_AVAGO_HSME-C110_DESIGN-GUIDE.pdf; ComponentLink1Description: Design Guide; Author: CERN DEM JMW; CreateDate: 2009-07-22; LatestRevisionDate: 2012-06-20
LED17 = LED_KINGBRIGHT_KPH-1608SURCK: LED Red 1C 2A; Part Description: SMD Hyper Red LED, Case 1.6mmX0.8mm(0603), 0.65mm Thickness; PressFit: No; Bonding: No; Part Number: LED_KINGBRIGHT_KPH-1608SURCK; Component Kind: Standard; Component Type: Standard; Color: Red; PackageDescription: SMT Hyper Red LED, Case 0603, Body L 1.6 x W 0.8mm H 0.65mm; Manufacturer: KINGBRIGHT; Manufacturer Part Number: KPH-1608SURCK; Pin Count: 2; Mounted: Yes; Socket: No; SMD: Yes; Sense: No; ComponentHeight: 0.65mm; HelpURL: \\cern.ch\dfs\Applications\Altium\Datasheets\LED_KINGBRIGHT_KPH-1608SURCK.pdf; Author: CERN DEM JLC; CreateDate: 03.07.2017; LatestRevisionDate: 03.07.2017
PB1 = SW_C&K_HDT0001: Push-Button Switch SPDT; Part Description: 5VDC 1mA SPST-NO Micro Mini Surface Surface Mount Detect Push-Button Switch, HDT Serie; Manufacturer: C&K; Table: Switches; Part Number: SW_C&K_HDT0001; Component Kind: Standard; Component Type: Standard; Pin Count: 4; PackageDescription: Body 3.5x2.8mm, Micro Mini Surface Mount Detect Switches, HDT Serie; Family: Push Button; Mounted: Yes; Socket: No; SMD: Yes; Status: None; Manufacturer Part Number: HDT0001; ComponentHeight: 3.35mm; HelpURL: \\cern.ch\dfs\Applications\Altium\Datasheets\SW_C&K_HDT0001.pdf; Author: CERN DEM JLC; CreateDate: 2012-08-15; LatestRevisionDate: 2012-08-15
PB2 = PB_ALPS_SKHHLMA010: Push-Button Switch SPDT; Part Description: 6x6mm, SPST Horizontal Pushbutton Switch, Stem height 3.85mm, Contact Rating 50mA 12VDC, SKHH Series; Manufacturer: ALPS; PressFit: No; Sense Comment: Non-washable; Part Number: PB_ALPS_SKHHLMA010; Component Kind: Standard; Component Type: Standard; Pin Count: 4; PackageDescription: Body 6x6mm, Stem height 3.85mm, Horizontal Pushbutton Switch, ALPS Serie SKHH; Family: Push Button; Mounted: Yes; Socket: No; SMD: No; Sense: Yes; Status: None; Manufacturer Part Number: SKHHLMA010; ComponentHeight: 7.4mm; HelpURL: \\cern.ch\dfs\Applications\Altium\Datasheets\PB_ALPS_SKHHLMA010.pdf; Author: CERN DEM JLC; CreateDate: 15.01.2009; LatestRevisionDate: 15.01.2009
R1 R35 R56 R60 R118 R139 R457-R459 R552 R555 = R0402_0R_JUMPER: Resistor; Manufacturer: GENERIC; Part Description: 1A (0.05R Max DC Resistance) Zero Ohm Jumper; Manufacturer1 Part Number: 232270591001L; PressFit: No; Manufacturer Part Number: R0402_0R_JUMPER; Part Number: R0402_0R_JUMPER; Value: 0; Component Kind: Standard; Component Type: Standard; Pin Count: 2; Status: Not Recommended; Case: 0402; Mounted: Yes; Sense: No; Socket: No; SMD: Yes; Manufacturer1 Example: YAGEO PHYCOMP; Manufacturer1 ComponentHeight: 0.4mm; HelpURL: \\cern.ch\dfs\Applications\Altium\Datasheets\R0402_Phycomp_RC0402.pdf; Author: CERN DEM JLC; CreateDate: 03.12.2007; LatestRevisionDate: 17.10.2012
R2-R5 R19 R97-R102 R238 = R0402_10K_1%_0.0625W_100PPM: Resistor - 1%; Part Description: General Purpose Thick Film Chip Resistor; Manufacturer: GENERIC; Manufacturer1 Part Number: 232270671003L; TC: ±100ppm/°C; Table: Resistors SMD; Part Number: R0402_10K_1%_0.0625W_100PPM; Component Kind: Standard; Component Type: Standard; Pin Count: 2; Value: 10k; Status: Not recommended; Power: 0.0625W; Tolerance: ±1%; Manufacturer Part Number: R0402_10K_1%_0.0625W_100PPM; Case: 0402; Mounted: Yes; Socket: No; SMD: Yes; Manufacturer1 Example: YAGEO PHYCOMP; Manufacturer1 ComponentHeight: 0.4mm; HelpURL: \\cern.ch\dfs\Applications\Altium\Datasheets\R0402_Phycomp_RC0402.pdf; Author: CERN DEM JLC; CreateDate: 2007-12-03; LatestRevisionDate: 2012-10-17
R6 R31 R33 R34 R121 R125 R126 R471 = R0402_10K_1%_0.0625W_100PPM: Resistor - 1%; Manufacturer: GENERIC; Part Description: General Purpose Thick Film Chip Resistor; Manufacturer1 Part Number: 232270671003L; TC: ±100ppm/°C; PressFit: No; Manufacturer Part Number: R0402_10K_1%_0.0625W_100PPM; Part Number: R0402_10K_1%_0.0625W_100PPM; Tolerance: ±1%; Value: 10k; Component Kind: Standard; Component Type: Standard; Pin Count: 2; Status: Not Recommended; Power: 0.0625W; Case: 0402; Mounted: Yes; Sense: No; Socket: No; SMD: Yes; Manufacturer1 Example: YAGEO PHYCOMP; Manufacturer1 ComponentHeight: 0.4mm; HelpURL: \\cern.ch\dfs\Applications\Altium\Datasheets\R0402_Phycomp_RC0402.pdf; Author: CERN DEM JLC; CreateDate: 03.12.2007; LatestRevisionDate: 17.10.2012
R7-R18 R96 R152 R153 R346 = R0402_100R_1%_0.0625W_100PPM: Resistor - 1%; Part Description: General Purpose Thick Film Chip Resistor; Manufacturer: GENERIC; Manufacturer1 Part Number: 232270671001L; TC: ±100ppm/°C; Table: Resistors SMD; Part Number: R0402_100R_1%_0.0625W_100PPM; Component Kind: Standard; Component Type: Standard; Pin Count: 2; Value: 100; Status: Not recommended; Power: 0.0625W; Tolerance: ±1%; Manufacturer Part Number: R0402_100R_1%_0.0625W_100PPM; Case: 0402; Mounted: Yes; Socket: No; SMD: Yes; Manufacturer1 Example: YAGEO PHYCOMP; Manufacturer1 ComponentHeight: 0.4mm; HelpURL: \\cern.ch\dfs\Applications\Altium\Datasheets\R0402_Phycomp_RC0402.pdf; Author: CERN DEM JLC; CreateDate: 2007-12-03; LatestRevisionDate: 2012-10-17
R20-R22 = R0402_4K7_1%_0.0625W_100PPM: Resistor - 1%; Part Description: General Purpose Thick Film Chip Resistor; Manufacturer: GENERIC; Manufacturer1 Part Number: 232270674702L; TC: ±100ppm/°C; Table: Resistors SMD; Part Number: R0402_4K7_1%_0.0625W_100PPM; Component Kind: Standard; Component Type: Standard; Pin Count: 2; Value: 4k7; Status: Not recommended; Power: 0.0625W; Tolerance: ±1%; Manufacturer Part Number: R0402_4K7_1%_0.0625W_100PPM; Case: 0402; Mounted: Yes; Socket: No; SMD: Yes; Manufacturer1 Example: YAGEO PHYCOMP; Manufacturer1 ComponentHeight: 0.4mm; HelpURL: \\cern.ch\dfs\Applications\Altium\Datasheets\R0402_Phycomp_RC0402.pdf; Author: CERN DEM JLC; CreateDate: 2007-12-03; LatestRevisionDate: 2012-10-17
R23 R24 R175 = R0402_330R_1%_0.0625W_100PPM: Resistor - 1%; Part Description: General Purpose Thick Film Chip Resistor; Manufacturer: GENERIC; Manufacturer1 Part Number: 232270673301L; TC: ±100ppm/°C; Table: Resistors SMD; Part Number: R0402_330R_1%_0.0625W_100PPM; Component Kind: Standard; Component Type: Standard; Pin Count: 2; Value: 330; Status: Not recommended; Power: 0.0625W; Tolerance: ±1%; Manufacturer Part Number: R0402_330R_1%_0.0625W_100PPM; Case: 0402; Mounted: Yes; Socket: No; SMD: Yes; Manufacturer1 Example: YAGEO PHYCOMP; Manufacturer1 ComponentHeight: 0.4mm; HelpURL: \\cern.ch\dfs\Applications\Altium\Datasheets\R0402_Phycomp_RC0402.pdf; Author: CERN DEM JLC; CreateDate: 2007-12-03; LatestRevisionDate: 2012-10-17
R32 R437 = R0402_100R_1%_0.1W_100PPM: Resistor - 1%; Manufacturer Part Number: R0402_100R_1%_0.1W_100PPM_50V; Manufacturer: GENERIC; Part Description: General Purpose Thick Film Chip Resistor; Manufacturer1 Part Number: ERJ2RKF1000X; Power: 0.1W; TC: ±100ppm/°C; Voltage: 50V; PressFit: No; Part Number: R0402_100R_1%_0.1W_100PPM; Tolerance: ±1%; Value: 100; Component Kind: Standard; Component Type: Standard; Pin Count: 2; Status: Not Recommended; Case: 0402; Mounted: Yes; Sense: No; Socket: No; SMD: Yes; Manufacturer1 Example: PANASONIC; Manufacturer1 ComponentHeight: 0.4mm; HelpURL: \\cern.ch\dfs\Applications\Altium\Datasheets\R0402_PANASONIC_ERJ2RK.pdf; Author: CERN DEM JLC; CreateDate: 12.12.2013; LatestRevisionDate: 03.03.2015
R47 R169 = R0402_2K2_1%_0.0625W_100PPM: Resistor - 1%; Part Description: General Purpose Thick Film Chip Resistor; Manufacturer: GENERIC; Manufacturer1 Part Number: 232270672202L; TC: ±100ppm/°C; Table: Resistors SMD; Part Number: R0402_2K2_1%_0.0625W_100PPM; Component Kind: Standard; Component Type: Standard; Pin Count: 2; Value: 2k2; Status: Not recommended; Power: 0.0625W; Tolerance: ±1%; Manufacturer Part Number: R0402_2K2_1%_0.0625W_100PPM; Case: 0402; Mounted: Yes; Socket: No; SMD: Yes; Manufacturer1 Example: YAGEO PHYCOMP; Manufacturer1 ComponentHeight: 0.4mm; HelpURL: \\cern.ch\dfs\Applications\Altium\Datasheets\R0402_Phycomp_RC0402.pdf; Author: CERN DEM JLC; CreateDate: 2007-12-03; LatestRevisionDate: 2012-10-17
R127 R472 = R0603_3K3_1%_0.1W_100PPM: Resistor - 1%; Part Description: General Purpose Thick Film Chip Resistor; Manufacturer: GENERIC; Manufacturer1 Part Number: NRC06F3301TRF; Power: 0.1W; TC: ±100ppm/°C; Table: Resistors SMD; Part Number: R0603_3K3_1%_0.1W_100PPM; Component Kind: Standard; Component Type: Standard; Pin Count: 2; Value: 3k3; Status: Preferred; Tolerance: ±1%; Manufacturer Part Number: R0603_3K3_1%_0.1W_100PPM; Case: 0603; Mounted: Yes; Socket: No; SMD: Yes; Manufacturer1 Example: NIC COMPONENT; Manufacturer1 ComponentHeight: 0.55mm; HelpURL: \\cern.ch\dfs\Applications\Altium\Datasheets\R0603_NIC_NRC.pdf; Author: CERN DEM JLC; CreateDate: 2007-12-03; LatestRevisionDate: 2008-03-13
R403 R406 = R0402_100K_1%_0.0625W_100PPM: Resistor - 1%; Part Description: General Purpose Thick Film Chip Resistor; Manufacturer: GENERIC; Manufacturer1 Part Number: 232270671004L; TC: ±100ppm/°C; Table: Resistors SMD; Part Number: R0402_100K_1%_0.0625W_100PPM; Component Kind: Standard; Component Type: Standard; Pin Count: 2; Value: 100k; Status: Not recommended; Power: 0.0625W; Tolerance: ±1%; Manufacturer Part Number: R0402_100K_1%_0.0625W_100PPM; Case: 0402; Mounted: Yes; Socket: No; SMD: Yes; Manufacturer1 Example: YAGEO PHYCOMP; Manufacturer1 ComponentHeight: 0.4mm; HelpURL: \\cern.ch\dfs\Applications\Altium\Datasheets\R0402_Phycomp_RC0402.pdf; Author: CERN DEM JLC; CreateDate: 2007-12-03; LatestRevisionDate: 2012-10-17
R441 R446 = R0402_1K_1%_0.0625W_100PPM: Resistor - 1%; Part Description: General Purpose Thick Film Chip Resistor; Manufacturer: GENERIC; Manufacturer1 Part Number: 232270671002L; TC: ±100ppm/°C; Table: Resistors SMD; Part Number: R0402_1K_1%_0.0625W_100PPM; Component Kind: Standard; Component Type: Standard; Pin Count: 2; Value: 1k; Status: Not recommended; Power: 0.0625W; Tolerance: ±1%; Manufacturer Part Number: R0402_1K_1%_0.0625W_100PPM; Case: 0402; Mounted: Yes; Socket: No; SMD: Yes; Manufacturer1 Example: YAGEO PHYCOMP; Manufacturer1 ComponentHeight: 0.4mm; HelpURL: \\cern.ch\dfs\Applications\Altium\Datasheets\R0402_Phycomp_RC0402.pdf; Author: CERN DEM JLC; CreateDate: 2007-12-03; LatestRevisionDate: 2012-10-17
R456 = R0402_3K9_1%_0.0625W_100PPM: Resistor - 1%; Part Description: General Purpose Thick Film Chip Resistor; Manufacturer: GENERIC; Manufacturer1 Part Number: 232270673902L; TC: ±100ppm/°C; PressFit: No; Part Number: R0402_3K9_1%_0.0625W_100PPM; Component Kind: Standard; Component Type: Standard; Pin Count: 2; Value: 3k9; Status: Not Recommended; Power: 0.0625W; Tolerance: ±1%; Manufacturer Part Number: R0402_3K9_1%_0.0625W_100PPM; Case: 0402; Mounted: Yes; Sense: No; Socket: No; SMD: Yes; Manufacturer1 Example: YAGEO PHYCOMP; Manufacturer1 ComponentHeight: 0.4mm; HelpURL: \\cern.ch\dfs\Applications\Altium\Datasheets\R0402_Phycomp_RC0402.pdf; Author: CERN DEM JLC; CreateDate: 03.12.2007; LatestRevisionDate: 17.10.2012
SW1 = SW_TYCO_1571983-4: 4 Ways SPST DIP Switch; Part Description: 4 Way SPST SMD DIP Switch, Latched, Contact Rating 0.025A 24VDC; Manufacturer: TYCO; Manufacturer Part Number: 1571983-4 or GDH04S04; PressFit: No; Part Number: SW_TYCO_1571983-4; Component Kind: Standard; Component Type: Standard; Pin Count: 8; PackageDescription: Pitch 1.27mm,  Body 6.2x6.2mm, 4 Ways SPST Surface-Mount DIP Switch, TYCO GDH Series; Family: Switch; Mounted: Yes; Socket: No; SMD: Yes; Sense: No; Status: None; ComponentHeight: 2.31mm; HelpURL: \\cern.ch\dfs\Applications\Altium\Datasheets\SW_TYCO_1571983-4.pdf; Author: CERN DEM JLC; CreateDate: 08.01.2009; LatestRevisionDate: 08.01.2009
T9 T16 = BSS138LT1G: N-CHANNEL MOSFET WITH DIODE; Manufacturer: ON SEMICONDUCTOR; Part Description: 50V 200mA N-Channel Enhancement Mode Field-Effect Transistor; PressFit: No; Bonding: No; Manufacturer Part Number: BSS138LT1G; PackageDescription: SOT23 3-Leads, Pitch 0.95mm - Body 1.4x3mm, IPC Medium Density; Part Number: BSS138LT1G; Component Kind: Standard; Component Type: Standard; Device: BSS138LT1G; Pin Count: 3; Case: SOT23-3; Mounted: Yes; Socket: No; SMD: Yes; Sense: No; ComponentHeight: 1.11mm; HelpURL: \\cern.ch\dfs\Applications\Altium\Datasheets\BSS138LT1G.pdf; Author: CERN DEM JLC; CreateDate: 23.03.2009; LatestRevisionDate: 23.03.2009
X1 = ECS-80-12-30-JGM-TR: Crystal; Manufacturer: ECS Incorporated; Load Capacitance: 12pF; Part Number: ECS-80-12-30-JGM-TR